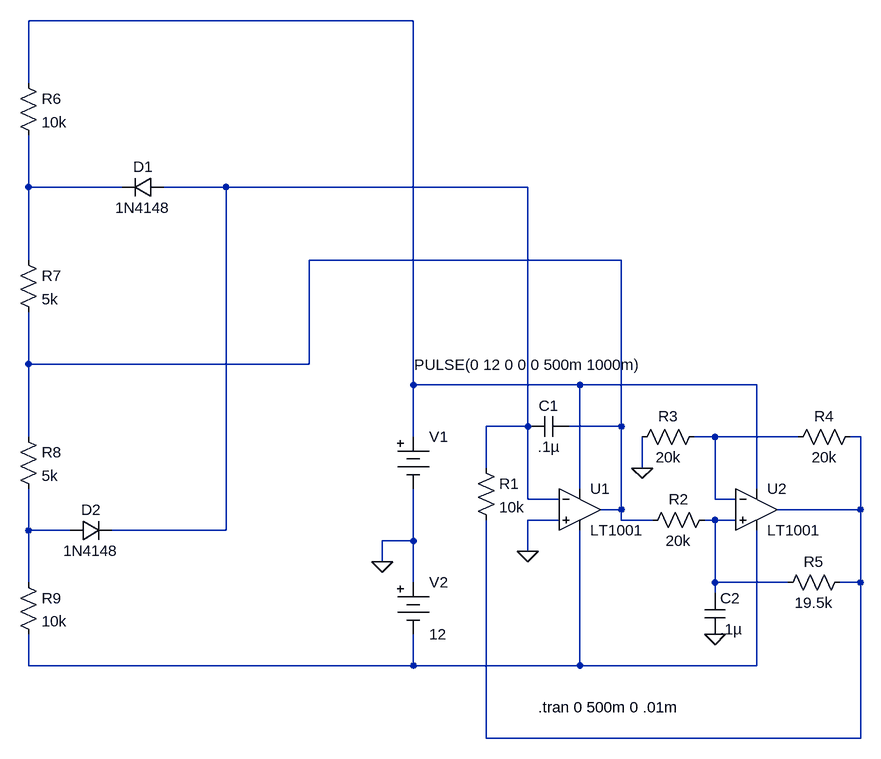
[diagram p0: schematic cuadratura2.asc]
cuadratura2.asc, the LTspice schematic file:
Version 4
SHEET 1 880 680
WIRE -96 -576 -688 -576
WIRE -688 -480 -688 -576
WIRE -688 -320 -688 -400
WIRE -544 -320 -688 -320
WIRE -384 -320 -480 -320
WIRE 80 -320 -384 -320
WIRE -688 -208 -688 -320
WIRE 224 -208 -256 -208
WIRE -688 -48 -688 -128
WIRE -256 -48 -256 -208
WIRE -256 -48 -688 -48
WIRE -96 -16 -96 -576
WIRE 160 -16 -96 -16
WIRE 432 -16 160 -16
WIRE 80 48 80 -320
WIRE 80 48 16 48
WIRE 224 48 224 -208
WIRE 224 48 144 48
WIRE -688 64 -688 -48
WIRE -96 64 -96 -16
WIRE 368 64 336 64
WIRE 496 64 368 64
WIRE 592 64 576 64
WIRE 16 112 16 48
WIRE 256 112 256 64
WIRE 160 144 160 -16
WIRE 432 144 432 -16
WIRE 80 160 80 48
WIRE 128 160 80 160
WIRE 368 160 368 64
WIRE 400 160 368 160
WIRE 224 176 224 48
WIRE 224 176 192 176
WIRE 592 176 592 64
WIRE 592 176 464 176
WIRE 128 192 80 192
WIRE 224 192 224 176
WIRE 272 192 224 192
WIRE 368 192 352 192
WIRE 400 192 368 192
WIRE -688 208 -688 144
WIRE -624 208 -688 208
WIRE -384 208 -384 -320
WIRE -384 208 -560 208
WIRE -96 224 -96 144
WIRE -96 224 -144 224
WIRE 80 240 80 192
WIRE -144 256 -144 224
WIRE -688 288 -688 208
WIRE -96 288 -96 224
WIRE 368 288 368 192
WIRE 480 288 368 288
WIRE 592 288 592 176
WIRE 592 288 560 288
WIRE 368 304 368 288
WIRE -688 416 -688 368
WIRE -96 416 -96 368
WIRE -96 416 -688 416
WIRE 160 416 160 208
WIRE 160 416 -96 416
WIRE 432 416 432 208
WIRE 432 416 160 416
WIRE 16 528 16 192
WIRE 592 528 592 288
WIRE 592 528 16 528
FLAG -144 256 0
FLAG 80 240 0
FLAG 256 112 0
FLAG 368 368 0
SYMBOL Opamps\\LT1001 160 112 R0
SYMATTR InstName U1
SYMBOL Opamps\\LT1001 432 112 R0
SYMATTR InstName U2
SYMBOL res 0 96 R0
SYMATTR InstName R1
SYMATTR Value 10k
SYMBOL cap 144 32 R90
WINDOW 0 0 32 VBottom 2
WINDOW 3 32 32 VTop 2
SYMATTR InstName C1
SYMATTR Value .1µ
SYMBOL Misc\\battery -96 48 R0
WINDOW 3 1 -95 Left 2
WINDOW 123 0 0 Left 2
WINDOW 39 0 0 Left 2
SYMATTR Value PULSE(0 12 0 0 0 500m 1000m)
SYMATTR InstName V1
SYMBOL Misc\\battery -96 272 R0
WINDOW 123 0 0 Left 2
WINDOW 39 0 0 Left 2
SYMATTR InstName V2
SYMATTR Value 12
SYMBOL res 368 176 R90
WINDOW 0 0 56 VBottom 2
WINDOW 3 32 56 VTop 2
SYMATTR InstName R2
SYMATTR Value 20k
SYMBOL res 352 48 R90
WINDOW 0 0 56 VBottom 2
WINDOW 3 32 56 VTop 2
SYMATTR InstName R3
SYMATTR Value 20k
SYMBOL res 592 48 R90
WINDOW 0 0 56 VBottom 2
WINDOW 3 32 56 VTop 2
SYMATTR InstName R4
SYMATTR Value 20k
SYMBOL res 576 272 R90
WINDOW 0 0 56 VBottom 2
WINDOW 3 32 56 VTop 2
SYMATTR InstName R5
SYMATTR Value 19.5k
SYMBOL cap 352 304 R0
SYMATTR InstName C2
SYMATTR Value .1µ
SYMBOL res -704 -496 R0
SYMATTR InstName R6
SYMATTR Value 10k
SYMBOL res -704 -224 R0
SYMATTR InstName R7
SYMATTR Value 5k
SYMBOL res -704 48 R0
SYMATTR InstName R8
SYMATTR Value 5k
SYMBOL res -704 272 R0
SYMATTR InstName R9
SYMATTR Value 10k
SYMBOL diode -480 -336 R90
WINDOW 0 0 32 VBottom 2
WINDOW 3 32 32 VTop 2
SYMATTR InstName D1
SYMATTR Value 1N4148
SYMBOL diode -624 224 R270
WINDOW 0 32 32 VTop 2
WINDOW 3 0 32 VBottom 2
SYMATTR InstName D2
SYMATTR Value 1N4148
TEXT 96 480 Left 2 !.tran 0 500m 0 .01m

The netlist it stands for:
* cuadratura2.asc
XU1 0 N003 N001 N009 N004 LT1001  ; pins In+ In- V+ V- OUT
XU2 N007 N005 N001 N009 N006 LT1001  ; pins In+ In- V+ V- OUT
R1 N003 N006 10k
C1 N004 N003 .1µ
V1 N001 0 PULSE(0 12 0 0 0 500m 1000m)
V2 0 N009 12
R2 N007 N004 20k
R3 N005 0 20k
R4 N006 N005 20k
R5 N006 N007 19.5k
C2 N007 0 .1µ
R6 N001 N002 10k
R7 N002 N004 5k
R8 N004 N008 5k
R9 N008 N009 10k
D1 N003 N002 1N4148
D2 N008 N003 1N4148
.model D D
.lib standard.dio
.tran 0 500m 0 .01m
.lib LTC.lib
.backanno
.end